# EAGLE schematic Domino Single USB (EAGLE 6.5.0)
DATABASE: ./../Common/BOM/Domino_DB.txt; DRAWN: M.STEMPIN; REV: D
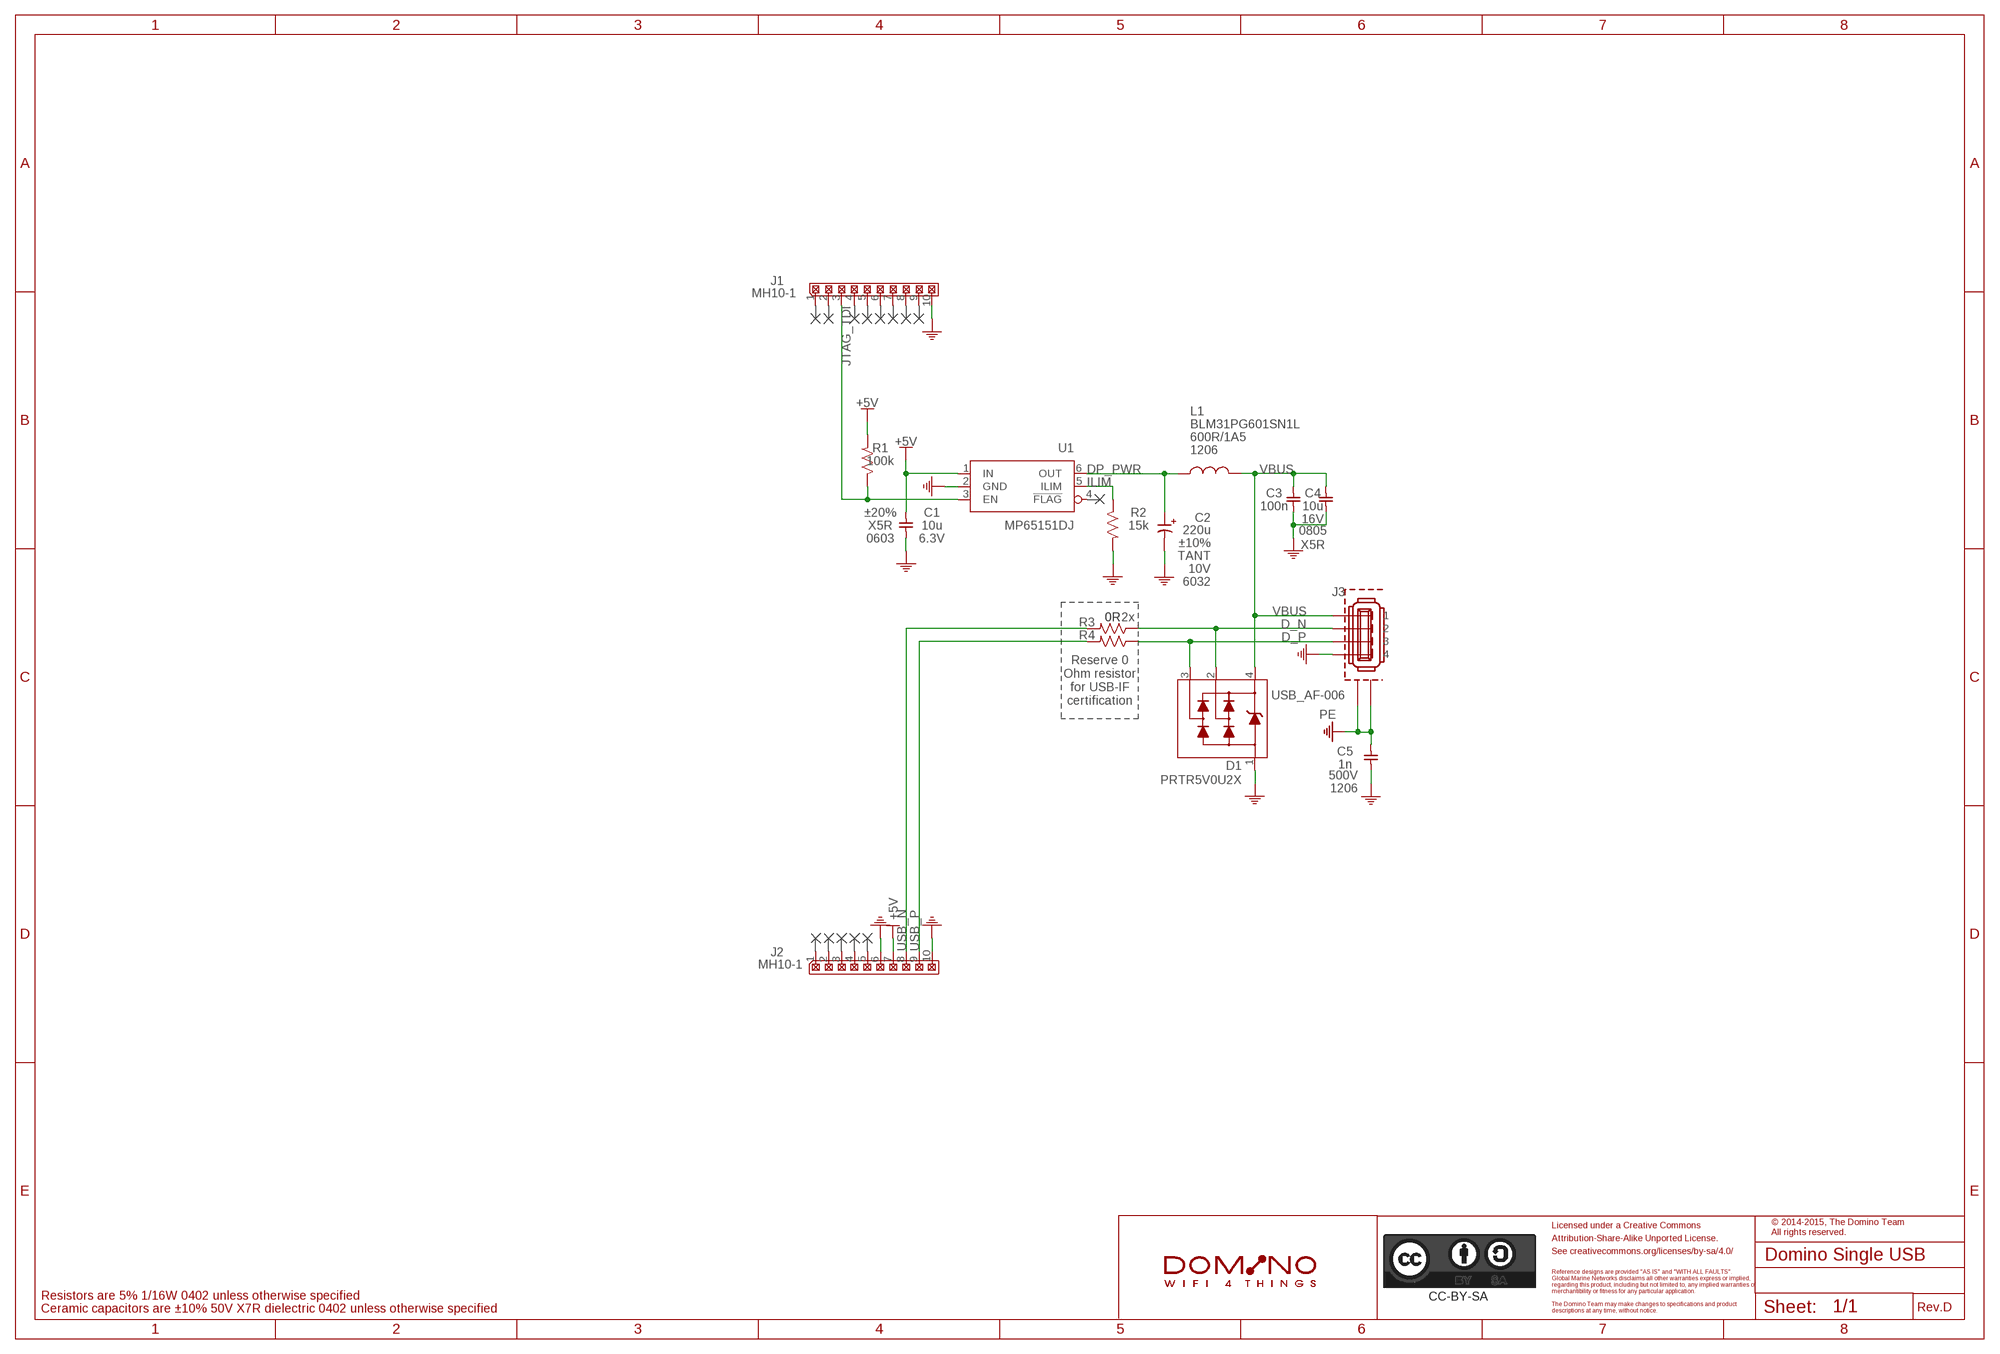
[diagram p0: schematic, sheet 1]
PORT1 (NC): BOM: EXCLUDE
PORT2 (NC): BOM: EXCLUDE
PORT3 (NC): BOM: EXCLUDE
PORT5 (NC): BOM: EXCLUDE
PORT6 (NC): BOM: EXCLUDE
PORT7 (NC): BOM: EXCLUDE
PORT8 (NC): BOM: EXCLUDE
PORT9 (NC): BOM: EXCLUDE
PORT10 (NC): BOM: EXCLUDE
PORT11 (NC): BOM: EXCLUDE
PORT12 (NC): BOM: EXCLUDE
PORT13 (NC): BOM: EXCLUDE
PORT14 (NC): BOM: EXCLUDE
PORT15 (NC): BOM: EXCLUDE

## Parts
C1  10u  CAP_0603  [C0603]
C2  220u  CPOL_C/6032-25  [C/6032-25]
C3  100n  CAP_0402  [C0402]
C4  10u  CAP_0805  [C0805]
C5  1n  CAP_1206  [C1206]
CC-BY-SA1  CC-BY-SA_LOGO  [CC-BY-SA_LOGO]
D1  PRTR5V0U2X  [SOT143B]
J1  MH10-1  [MH10-1-0.1]
J2  MH10-1  [MH10-1-0.1]
J3  USB_AF-006  [USB_AF-006]
L1  BLM31PG601SN1L  FB_1206  [FB1206]
R1  100k  RES_0402  [R0402]
R2  15k  RES_0402  [R0402]
R3  0R  RES_0402  [R0402]
R4  0R  RES_0402  [R0402]
S1  DOMINO_LOGO  [DOMINO_LOGO]
U1  MP65151DJ  [SOT23-6]

## Nets
+5V: C1.1 J2.7 R1.2 U1.1(IN)
D_N [USB]: D1.2 J3.2 R3.1
D_P [USB]: D1.3 J3.3 R4.1
DP_PWR: C2.1(+) L1.1 U1.6(OUT)
GND: C1.2 C2.2(-) C3.2 C4.2 C5.2 D1.1 J1.10 J2.6 J2.10 J3.4 R2.2 U1.2(GND)
ILIM: R2.1 U1.5(ILIM)
JTAG_TDI: J1.3 R1.1 U1.3(EN)
PE: C5.1 J3.S$1(G) J3.S$2(G)
USB_N [USB]: J2.8 R3.2
USB_P [USB]: J2.9 R4.2
VBUS: C3.1 C4.1 D1.4 J3.1 L1.2
Unconnected: J1.1 J1.2 J1.4 J1.5 J1.6 J1.7 J1.8 J1.9 J2.1 J2.2 J2.3 J2.4 J2.5 U1.4(!FLAG)

## Notes on the sheet
- 2x
- Reserve 0
  Ohm resistor
  for USB-IF
  certification
- Licensed under a Creative Commons
- © 2014-2015, The Domino Team
  All rights reserved.
- Attribution-Share-Alike Unported License.
- See creativecommons.org/licenses/by-sa/4.0/
- Reference designs are provided "AS IS" and "WITH ALL FAULTS".
- Global Marine Networks disclaims all other warranties express or implied,
- regarding this product, including but not limited to, any implied warranties of
- merchantibility or fitness for any particular application.
- Resistors are 5% 1/16W 0402 unless otherwise specified
- The Domino Team may make changes to specifications and product
- Ceramic capacitors are ±10% 50V X7R dielectric 0402 unless otherwise specified | descriptions at any time, without notice. | Rev.

## Library data of the parts
C1 = Domino:CAP_: Capacitor; PARTNO: C0603_10u_X5R_20%_CER_6V3; SIZE: 0603; TC: X5R; TOL: ±20%; TYPE: CER; VOLT: 6.3V
C2 = Domino:CPOL_?*: Polarized Capacitor; PARTNO: CPOLC-6032_220u_20%_TANT_10V; SIZE: 6032; TOL: ±10%; TYPE: TANT; VOLT: 10V
C3 = Domino:CAP_: Capacitor; PARTNO: C0402_100n_X7R_10%_CER_50V; SIZE: 0402; TC: X7R; TOL: ±10%; TYPE: CER; VOLT: 50V
C4 = Domino:CAP_: Capacitor; PARTNO: C0805_10u_X5R_10%_CER_16V; SIZE: 0805; TC: X5R; TOL: ±10%; TYPE: CER; VOLT: 16V
C5 = Domino:CAP_: Capacitor; PARTNO: C1206_1n_X7R_10%_CER_500V; SIZE: 1206; TC: X7R; TOL: ±10%; TYPE: CER; VOLT: 500V
CC-BY-SA1 = Domino:CC-BY-SA_LOGO: Attribution-Share-Alike Unported License See creativecommons.org/licenses/by-sa/3.0/ for details.; BOM: EXCLUDE
D1 = Domino:PRTR5V0U2X: Ultra low capacitance double rail-to-rail ESD protection diode; PARTNO: PRTR5V0U2X; RATE: 300W; VOLT: 5V
J1 J2 = Domino:MH10-1: 10x1 Pin Male Header; PARTNO: MH10-1-0.1
J3 = Domino:USB_AF-006: USB-A Right/Angle SMT Connector; PARTNO: USB_AF-006
L1 = Domino:FB_: Ferrite Bead; OPT: 600R/1A5; PARTNO: BLM31PG601SN1L; SIZE: 1206
R1 = Domino:RES_: Resistor; PARTNO: R0402_100k_5%_62.5mW; RATE: 62.5mW; SIZE: 0402; TOL: 5%
R2 = Domino:RES_: Resistor; PARTNO: R0402_15k_5%_62.5mW; RATE: 62.5mW; SIZE: 0402; TOL: 5%
R3 R4 = Domino:RES_: Resistor; PARTNO: R0402_0R_5%_62.5mW; RATE: 62.5mW; SIZE: 0402; TOL: 5%
S1 = Domino:DOMINO_LOGO: Domino Logo; BOM: EXCLUDE
U1 = Domino:MP65151DJ: Precision 60mA-1.7A Programmable Current-Limited Power Distribution Switch; PARTNO: MP65151DJ

## Net classes
1 USB: width 0.368 mm, clearance 0.152 mm to class 0, clearance 0.152 mm
2 PoE: width 0.457 mm, clearance 0.254 mm to class 0, clearance 0.254 mm to class 1, clearance 0.254 mm